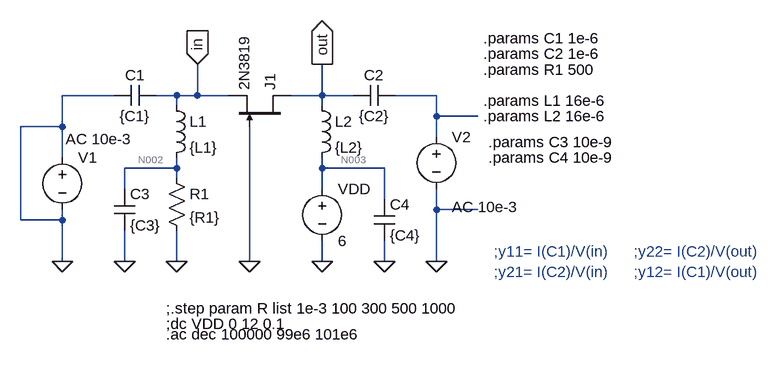
[diagram p0: schematic parametosY_2N3819.asc]
parametosY_2N3819.asc, the LTspice schematic file:
Version 4
SHEET 1 948 680
WIRE -80 48 -160 48
WIRE 16 48 -16 48
WIRE 48 48 48 0
WIRE 48 48 16 48
WIRE 96 48 48 48
WIRE 240 48 240 0
WIRE 240 48 192 48
WIRE 288 48 240 48
WIRE 416 48 352 48
WIRE 16 64 16 48
WIRE 240 64 240 48
WIRE 416 80 416 48
WIRE 480 80 416 80
WIRE -160 96 -160 48
WIRE -160 96 -224 96
WIRE 416 112 416 80
WIRE -160 144 -160 96
WIRE 16 160 16 144
WIRE 16 160 -64 160
WIRE 240 160 240 144
WIRE 336 160 240 160
WIRE 16 176 16 160
WIRE -64 192 -64 160
WIRE 240 192 240 160
WIRE 336 208 336 160
WIRE 416 224 416 192
WIRE 480 224 416 224
WIRE -224 240 -224 96
WIRE -160 240 -160 224
WIRE -160 240 -224 240
WIRE -160 304 -160 240
WIRE -64 304 -64 256
WIRE 16 304 16 256
WIRE 128 304 128 96
WIRE 240 304 240 272
WIRE 336 304 336 272
WIRE 416 304 416 224
FLAG 416 304 0
FLAG 240 304 0
FLAG 128 304 0
FLAG 16 304 0
FLAG -160 304 0
FLAG -64 304 0
FLAG 336 304 0
FLAG 48 0 in
IOPIN 48 0 In
FLAG 240 0 out
IOPIN 240 0 Out
SYMBOL njf 192 96 M270
SYMATTR InstName J1
SYMATTR Value 2N3819
SYMBOL res 0 160 R0
SYMATTR InstName R1
SYMATTR Value {R1}
SYMBOL voltage -160 128 R0
WINDOW 123 5 -13 Left 2
WINDOW 39 0 0 Left 0
SYMATTR InstName V1
SYMATTR Value ""
SYMATTR Value2 AC 10e-3
SYMBOL cap -16 32 R90
WINDOW 0 0 32 VBottom 2
WINDOW 3 32 32 VTop 2
SYMATTR InstName C1
SYMATTR Value {C1}
SYMBOL cap 352 32 R90
WINDOW 0 0 32 VBottom 2
WINDOW 3 32 32 VTop 2
SYMATTR InstName C2
SYMATTR Value {C2}
SYMBOL voltage 240 176 R0
WINDOW 123 0 0 Left 0
WINDOW 39 0 0 Left 0
SYMATTR InstName VDD
SYMATTR Value 6
SYMBOL ind 0 48 R0
SYMATTR InstName L1
SYMATTR Value {L1}
SYMBOL ind 224 48 R0
SYMATTR InstName L2
SYMATTR Value {L2}
SYMBOL cap -80 192 R0
SYMATTR InstName C3
SYMATTR Value {C3}
SYMBOL cap 320 208 R0
SYMATTR InstName C4
SYMATTR Value {C4}
SYMBOL voltage 416 96 R0
WINDOW 123 24 124 Left 2
WINDOW 39 0 0 Left 0
SYMATTR InstName V2
SYMATTR Value ""
SYMATTR Value2 AC 10e-3
TEXT 0 376 Left 2 !;.step param R list 1e-3 100 300 500 1000
TEXT 488 -40 Left 2 !.params C1 1e-6
TEXT 488 -16 Left 2 !.params C2 1e-6
TEXT 488 8 Left 2 !.params R1 500
TEXT 0 400 Left 2 !;dc VDD 0 12 0.1
TEXT 488 56 Left 2 !.params L1 16e-6
TEXT 488 80 Left 2 !.params L2 16e-6
TEXT 496 120 Left 2 !.params C3 10e-9
TEXT 496 144 Left 2 !.params C4 10e-9
TEXT 0 416 Left 2 !.ac dec 100000 99e6 101e6
TEXT 504 288 Left 2 ;;y11= I(C1)/V(in)
TEXT 504 320 Left 2 ;;y21= I(C2)/V(in)
TEXT 720 320 Left 2 ;;y12= I(C1)/V(out)
TEXT 720 288 Left 2 ;;y22= I(C2)/V(out)

The netlist it stands for:
* parametosY_2N3819.asc
J1 out 0 in 2N3819
R1 N002 0 {R1}
V1 0 0 AC 10e-3
C1 in 0 {C1}
C2 N001 out {C2}
VDD N003 0 6
L1 in N002 {L1}
L2 out N003 {L2}
C3 N002 0 {C3}
C4 N003 0 {C4}
V2 N001 0 AC 10e-3
.model NJF NJF
.model PJF PJF
.lib standard.jft
;.step param R list 1e-3 100 300 500 1000
.params C1 1e-6
.params C2 1e-6
.params R1 500
;dc VDD 0 12 0.1
.params L1 16e-6
.params L2 16e-6
.params C3 10e-9
.params C4 10e-9
.ac dec 100000 99e6 101e6
* ;y11= I(C1)/V(in)
* ;y21= I(C2)/V(in)
* ;y12= I(C1)/V(out)
* ;y22= I(C2)/V(out)
.backanno
.end

* Results of the author's LTspice run, read from the files saved beside the schematic
* Operating Point, zero values left out:
*   V(out) = 6 V
*   V(in) = 1.492 V
*   V(n002) = 1.492 V
*   V(n003) = 6 V
*   I(L2) = -2.984 mA
*   I(L1) = 2.984 mA
*   Id(J1) = 2.984 mA
*   Ig(J1) = -8.66 pA
*   Is(J1) = -2.984 mA
*   I(R1) = 2.984 mA
*   I(Vdd) = -2.984 mA
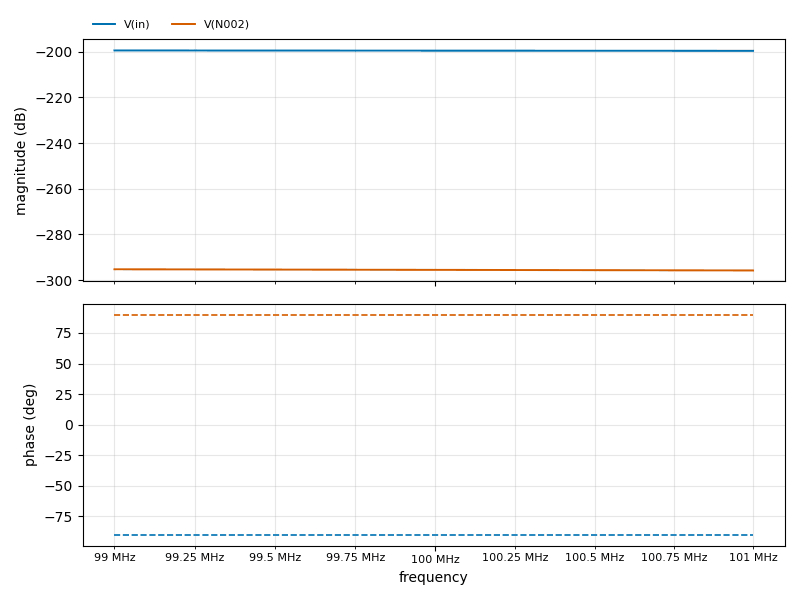
[diagram p1: AC Analysis of parametosY_2N3819.asc, plotted from the saved traces]
* AC Analysis, 1 run:
*   V(in): -199.46 dB at 99 MHz, -199.63 dB at 101 MHz, peak -199.46 dB at 99 MHz
*   V(N002): -295.29 dB at 99 MHz, -295.82 dB at 101 MHz, peak -295.29 dB at 99 MHz